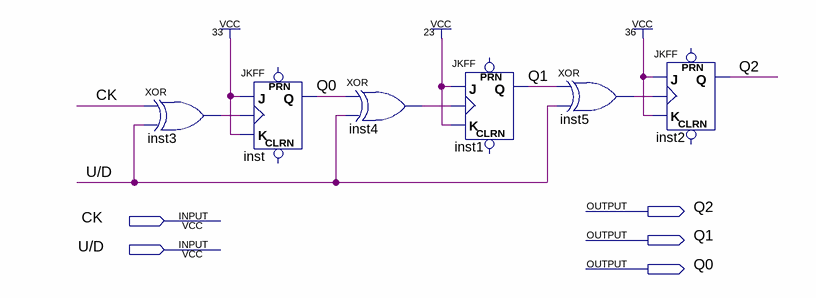
[diagram p0: schematic sheet]
// Quartus schematic 8_MOD_A_U_D.bdf as structural Verilog: 6 symbols, 5 pins
module \8_MOD_A_U_D  (
  input  CK,
  input  \U/D ,
  output Q2,
  output Q1,
  output Q0
);

  wire inst3_out, inst4_out, inst5_out;

  xor inst3 (inst3_out, CK, \U/D );
  JKFF inst (.K(1'b1), .J(1'b1), .CLK(inst3_out), .Q(Q0));  // open: PRN, CLRN
  xor inst4 (inst4_out, Q0, \U/D );
  JKFF inst1 (.K(1'b1), .J(1'b1), .CLK(inst4_out), .Q(Q1));  // open: PRN, CLRN
  xor inst5 (inst5_out, Q1, \U/D );
  JKFF inst2 (.K(1'b1), .J(1'b1), .CLK(inst5_out), .Q(Q2));  // open: PRN, CLRN
endmodule
